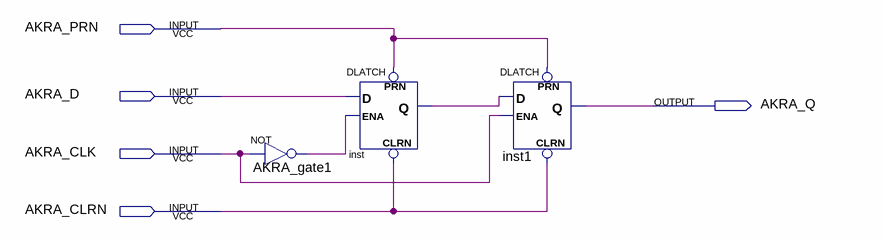
[diagram p0: schematic sheet]
// Quartus schematic Akram_D_FlipFlop_Master_Slave.bdf as structural Verilog: 3 symbols, 5 pins
module Akram_D_FlipFlop_Master_Slave (
  input  AKRA_PRN,
  input  AKRA_D,
  input  AKRA_CLK,
  input  AKRA_CLRN,
  output AKRA_Q
);

  wire AKRA_gate1_out, inst_q;

  not AKRA_gate1 (AKRA_gate1_out, AKRA_CLK);
  DLATCH inst (.CLRN(AKRA_CLRN), .D(AKRA_D), .ENA(AKRA_gate1_out), .PRN(AKRA_PRN), .Q(inst_q));
  DLATCH inst1 (.CLRN(AKRA_CLRN), .D(inst_q), .ENA(AKRA_CLK), .PRN(AKRA_PRN), .Q(AKRA_Q));
endmodule
